# EAGLE schematic schem-v1 (EAGLE 9.6.2)
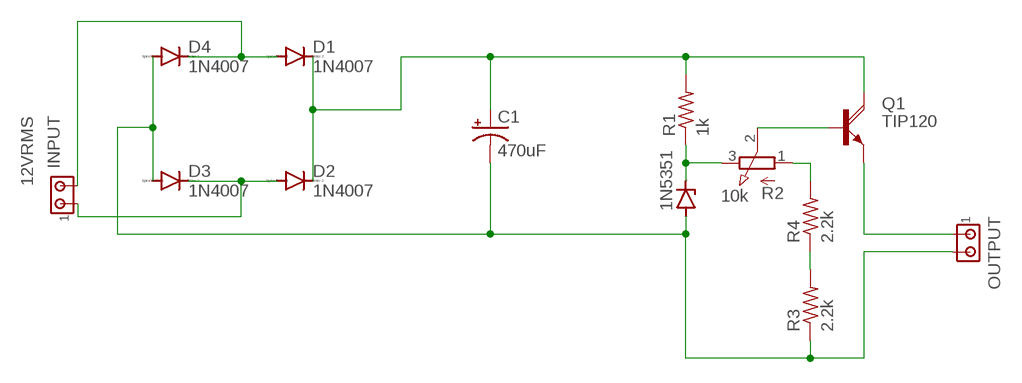
[diagram p0: schematic, sheet 1]

## Parts
1N5351  ZENER-DIODEDO41Z10  [DO41Z10]
C1  470uF  CPOL-USE3.5-10  [E3,5-10]
D1  1N4007  1N4004  [DO41-10]
D2  1N4007  1N4004  [DO41-10]
D3  1N4007  1N4004  [DO41-10]
D4  1N4007  1N4004  [DO41-10]
INPUT  12VRMS  MTA02-100  [10X02MTA]
OUTPUT  MTA02-100  [10X02MTA]
Q1  TIP120  [TO220AH]
R1  1k  R-US_0207/10  [0207/10]
R2  10k  3RP/1610N  [3RP/1610N]
R3  2.2k  R-US_0207/10  [0207/10]
R4  2.2k  R-US_0207/10  [0207/10]

## Nets
GND: 1N5351.A C1.- D3.A D4.A OUTPUT.2 R3.1
N$1: D1.A D4.C INPUT.2
N$2: D2.A D3.C INPUT.1
N$3: 1N5351.C R1.1 R2.3(E)
N$4: R2.1(A) R4.2
N$5: R3.2 R4.1
N$6: Q1.B R2.2(S)
N$7: OUTPUT.1 Q1.E
VCC: C1.+ D1.C D2.C Q1.C R1.2

## Library data of the parts
1N5351 = diode:ZENER-DIODE: Z-Diode
C1 = rcl:CPOL-US: POLARIZED CAPACITOR, American symbol; SPICEPREFIX: C
D1-D4 = diode:1N4004: DIODE general purpose rectifier, 1 A
INPUT = con-amp:MTA02-100: AMP connector; SPICEPREFIX: I
OUTPUT = con-amp:MTA02-100: AMP connector
Q1 = transistor-power:TIP120: NPN DARLINGTON TRANSISTOR
R1 R3 R4 = rcl:R-US_: RESISTOR, American symbol; SPICEPREFIX: R
R2 = pot:3RP/1610N: 16mm Potentiometer one level Source: http://www.alphapotentiometers.net/html/16mm_pot_2.html